# EAGLE schematic 214_oled_9 (EAGLE 9.1.0)
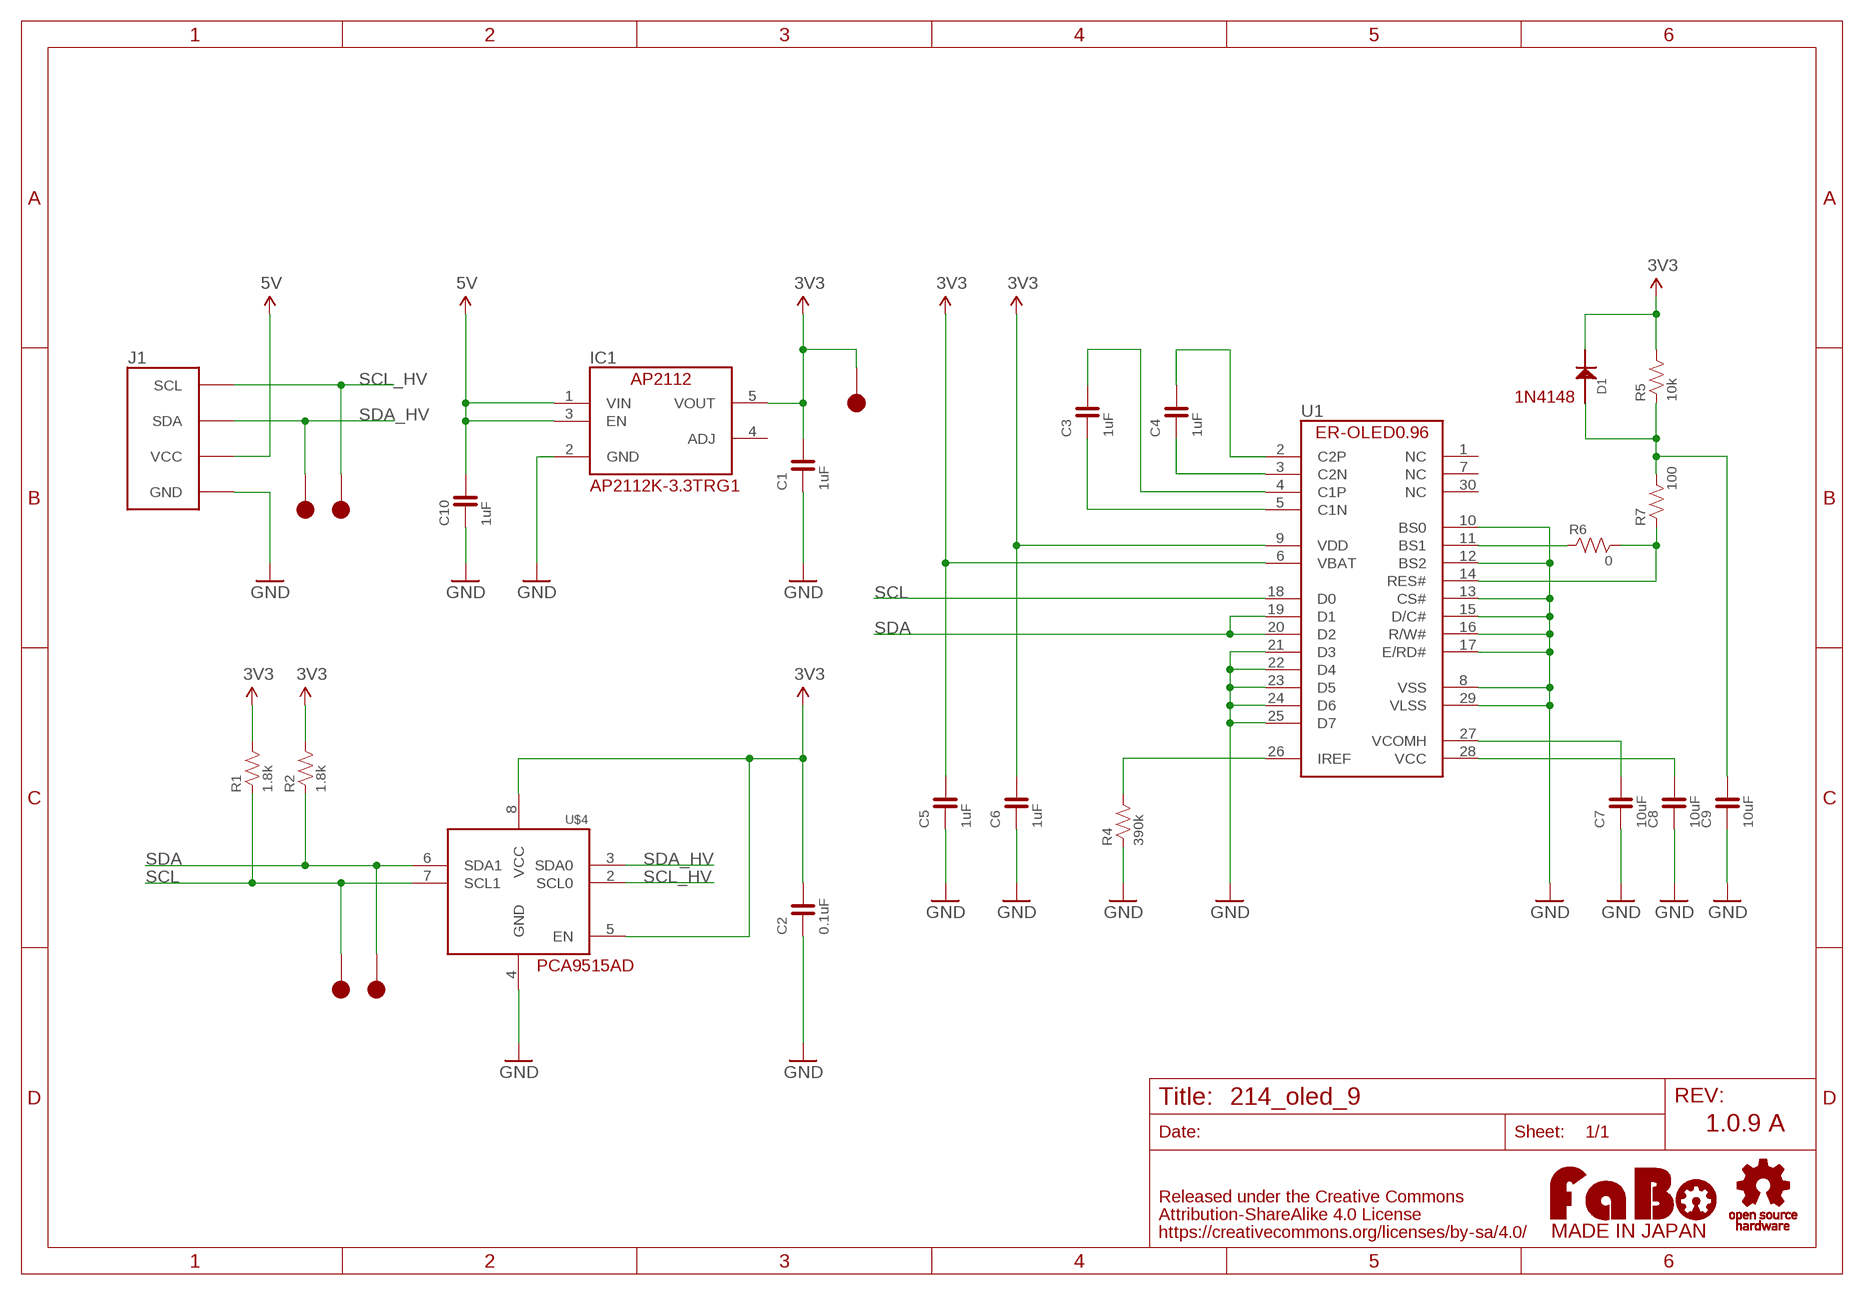
[diagram p0: schematic, sheet 1]

## Parts
C1  1uF  CAPACITOR-0603  [0603]
C2  0.1uF  CAPACITOR-0603  [0603]
C3  1uF  CAPACITOR-0603  [0603]
C4  1uF  CAPACITOR-0603  [0603]
C5  1uF  CAPACITOR-0603  [0603]
C6  1uF  CAPACITOR-0603  [0603]
C7  10uF  CAPACITOR-0603  [0603]
C8  10uF  CAPACITOR-0603  [0603]
C9  10uF  CAPACITOR-0603  [0603]
C10  1uF  CAPACITOR-0603  [0603]
D1  1N4148  [1N4148W]
IC1  AP2112K-3.3TRG1  [SOT-23-5]
J1  FABO_BRICK_I2C-OLED  [FABO_BRICK_I2C_OLED]
R1  1.8k  RESISTOR-0603  [0603]
R2  1.8k  RESISTOR-0603  [0603]
R4  390k  RESISTOR-0603  [0603]
R5  10k  RESISTOR-0603  [0603]
R6  0  RESISTOR-0603  [0603]
R7  100  RESISTOR-0603  [0603]
TP1  TP-15  [TP-15]
TP2  TP-15  [TP-15]
TP3  TP-15  [TP-15]
TP4  TP-15  [TP-15]
TP5  TP-15  [TP-15]
U1  ER-OLED0.96-1  [ER-OLED0.96-1]
U$2  LOGO_OSHW-M  [LOGO_OSHW_M]
U$3  LOGO_FABO-M_BOTTOM  [LOGO_FABO_MS_BOTTOM]
U$4  PCA9515  [SO8]

## Nets
3V3: C1.2 C2.2 C5.2 C6.2 D1.CATHODE IC1.5(VOUT) R1.2 R2.2 R5.2 TP5.1 U1.6(VBAT) U1.9(VDD) U$4.5(EN) U$4.8(VCC)
5V: C10.2 IC1.1(VIN) IC1.3(EN) J1.VCC
GND: C1.1 C2.1 C5.1 C6.1 C7.1 C8.1 C9.1 C10.1 IC1.2(GND) J1.GND R4.1 U1.8(VSS) U1.10(BS0) U1.12(BS2) U1.13(CS#) U1.15(D/C#) U1.16(R/W#) U1.17(E/RD#) U1.21(D3) U1.22(D4) U1.23(D5) U1.24(D6) U1.25(D7) U1.29(VLSS) U$4.4(GND)
N$1: C3.2 U1.4(C1P)
N$2: C3.1 U1.5(C1N)
N$3: C4.1 U1.3(C2N)
N$4: C4.2 U1.2(C2P)
N$5: R4.2 U1.26(IREF)
N$6: C7.2 U1.27(VCOMH)
N$7: C8.2 U1.28(VCC)
N$9: R6.1 U1.11(BS1)
N$10: R6.2 R7.1 U1.14(RES#)
N$12: C9.2 D1.ANODE R5.1 R7.2
SCL: R1.1 TP2.1 U1.18(D0) U$4.7(SCL1)
SCL_HV: J1.SCL TP4.1 U$4.2(SCL0)
SDA: R2.1 TP1.1 U1.19(D1) U1.20(D2) U$4.6(SDA1)
SDA_HV: J1.SDA TP3.1 U$4.3(SDA0)
Unconnected: IC1.4(ADJ) U1.1(NC) U1.7(NC) U1.30(NC)

## Notes on the sheet
- 1N4148
- AP2112K-3.3TRG1
- PCA9515AD
- 1.0.9 A

## Library data of the parts
C1-C10 = FaBo-Capacitor:CAPACITOR: CAPACITOR
D1 = FaBo-Diode:1N4148
IC1 = FaBo-Supply:AP2112
J1 = FaBo-Template:FABO_BRICK_I2C: FaBo Brick I2C
R1 R2 R4-R7 = FaBo-Resistors:RESISTOR: RESISTOR
TP1-TP5 = FaBo-Supply:TP
U1 = FaBo-Parts:ER-OLED0.96-1
U$2 = FaBo-etc:LOGO_OSHW
U$3 = FaBo-etc:LOGO_FABO
U$4 = FaBo-Repeater:PCA9515